# Altium schematic sheet DoorSensor-Remote_Lora.SchDoc
size A4; SheetNumber: 1; SheetTotal: 1
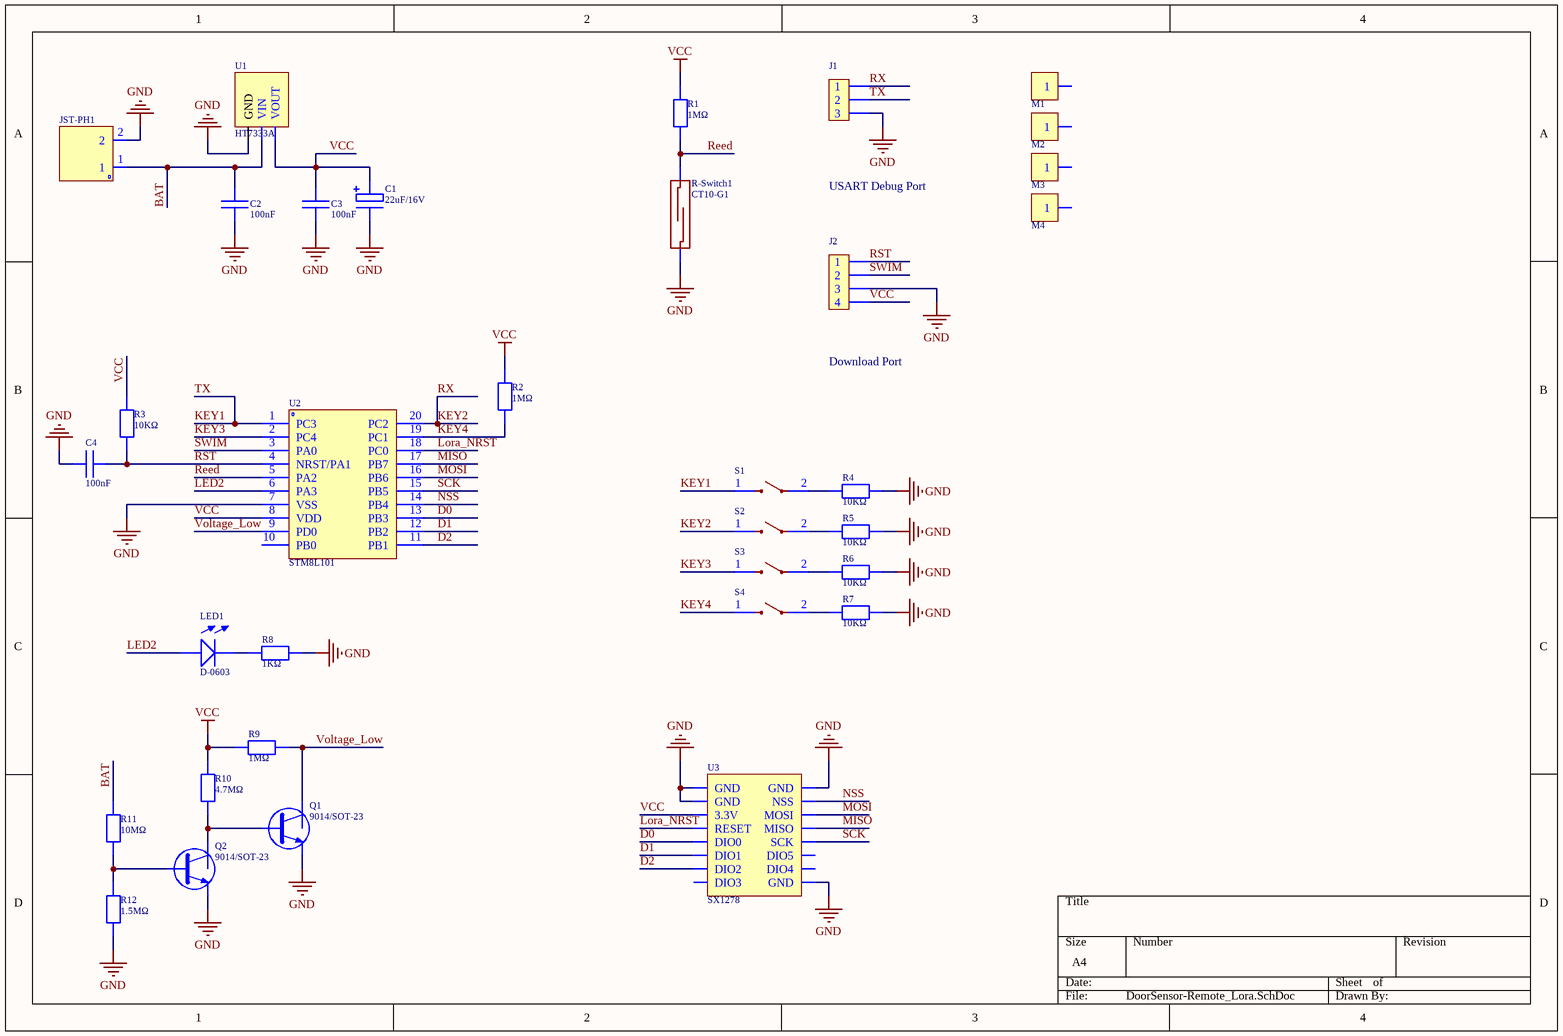
[diagram p0: DoorSensor-Remote_Lora.SchDoc]

## Parts
C1  22uF/16V  [C(Electrolytic)_SMD-D4.0mm_L5.4mm]
C2  100nF  [C0603]
C3  100nF  [C0603]
C4  100nF  [C0603]
J1  PinHeader_3Pin  [PinHeader_3Pin-2.54mm]  (value not drawn)
J2  PinHeader_4Pin  [PinHeader_4Pin-2.54mm]  (value not drawn)
JST-PH1  JST-PH2.0_2Pin-TH-Vertical  [Connector-JST-PH2.0-2Pin_TH-Vertical]  (value not drawn)
LED1  D-0603  [LED0603-Castellated]
M1  PCB Mounting Hole  [PCB Mounting Hole]  (value not drawn)
M2  PCB Mounting Hole  [PCB Mounting Hole]  (value not drawn)
M3  PCB Mounting Hole  [PCB Mounting Hole]  (value not drawn)
M4  PCB Mounting Hole  [PCB Mounting Hole]  (value not drawn)
Q1  9014/SOT-23  [SOT-23-3]
Q2  9014/SOT-23  [SOT-23-3]
R1  1MΩ  [R0603]
R2  1MΩ  [R0603]
R3  10KΩ  [R0805]
R4  10KΩ  [R0603]
R5  10KΩ  [R0603]
R6  10KΩ  [R0603]
R7  10KΩ  [R0603]
R8  1KΩ  [R0603]
R9  1MΩ  [R0603]
R10  4.7MΩ  [R0603]
R11  10MΩ  [R0603]
R12  1.5MΩ  [R0603]
R-Switch1  CT10-G1  [Reed Switch_Molded-SMD_SPST]
S1  CK_RS282G05A3  [Tactile Button_SMD-SPST_L6.1-W3.7-H2.5]  (value not drawn)
S2  CK_RS282G05A3  [Tactile Button_SMD-SPST_L6.1-W3.7-H2.5]  (value not drawn)
S3  CK_RS282G05A3  [Tactile Button_SMD-SPST_L6.1-W3.7-H2.5]  (value not drawn)
S4  CK_RS282G05A3  [Tactile Button_SMD-SPST_L6.1-W3.7-H2.5]  (value not drawn)
U1  HT7333A  [SOT89-3]
U2  STM8L101  [TSSOP-20_4.4x6.5mm_P0.65mm]
U3  SX1278  [SX1278_Ra-02-Lora Module_17x16mm]

## Nets
GND: C1.2 C2.1 C3.1 C4.1 J1.3 J2.3 JST-PH1.2 Q1.2 Q2.2 R4.2 R5.2 R6.2 R7.2 R8.2 R12.1 R-Switch1.1 U1.1(GND) U2.7(VSS) U3.1(GND) U3.2(GND) U3.9(GND) U3.16(GND)
VCC: C1.1 C3.2 J2.4 R1.2 R2.2 R3.2 R9.1 R10.2 U1.3(VOUT) U2.8(VDD) U3.3(3.3V)
BAT: C2.2 JST-PH1.1 R11.2 U1.2(VIN)
D0: U2.13(PB3) U3.5(DIO0)
D1: U2.12(PB2) U3.6(DIO1)
D2: U2.11(PB1) U3.7(DIO2)
KEY1: J1.2 S1.1 U2.1(PC3)  [also labelled TX]
KEY2: J1.1 S2.1 U2.20(PC2)  [also labelled RX]
KEY3: S3.1 U2.2(PC4)
KEY4: R2.1 S4.1 U2.19(PC1)
LED2: LED1.1 U2.6(PA3)
Lora_NRST: U2.18(PC0) U3.4(RESET)
MISO: U2.17(PB7) U3.13(MISO)
MOSI: U2.16(PB6) U3.14(MOSI)
NSS: U2.14(PB4) U3.15(NSS)
Reed: R1.1 R-Switch1.2 U2.5(PA2)
RST: C4.2 J2.1 R3.1 U2.4(NRST/PA1)
SCK: U2.15(PB5) U3.12(SCK)
SWIM: J2.2 U2.3(PA0)
Voltage_Low: Q1.3 R9.2 U2.9(PD0)
NetLED1_2: LED1.2 R8.1
NetQ1_1: Q1.1 Q2.3 R10.1
NetQ2_1: Q2.1 R11.1 R12.2
NetR4_1: R4.1 S1.2
NetR5_1: R5.1 S2.2
NetR6_1: R6.1 S3.2
NetR7_1: R7.1 S4.2

Not connected (* = marked no-connect by the designer): M1 1; M2 1; M3 1; M4 1; U2 10(PB0); U3 8(DIO3) 10(DIO4) 11(DIO5)

## Notes on the sheet
- USART Debug Port
- Download Port

## Library data of the parts
C1 = Capacitor_Electrolytic-SMD-D4.0xL5.4mm: Value: 22uF/16V
C2-C4 = Capacitor_0603: Value: 100nF
J1 = PinHeader_3Pin: Straight Single Row, Square Pitch, 2.54mm
J2 = PinHeader_4Pin: Straight Single Row, Square Pitch, 2.54mm
LED1 = LED_0603: Value: D-0603
M1-M4 = PCB Mounting Hole: Mounting Hole
Q1 Q2 = NPN_SOT-23-3: Value: 9014/SOT-23
R1 R2 R4-R12 = Resistor_0603
  R1 R2 R9: Value: 1MΩ
  R4-R7: Value: 10KΩ
  R8: Value: 1KΩ
  R10: Value: 4.7MΩ
  R11: Value: 10MΩ
  R12: Value: 1.5MΩ
R3 = Resistor_0805: Value: 10KΩ
R-Switch1 = Reed-Switch_Molded-SMD: Value: CT10-G1
S1-S4 = Button_Push_2Pin_SMD: Value: CK_RS282G05A3
U1 = LDO_SOT89-3: Value: HT7333A
U2 = STM8L101_TSSOP-20: 4.4x6.5mm_P0.65mm; Value: STM8L101
U3 = SX1278_Ra-02-Lora Module: 17x16mm